# Altium schematic sheet 795484912NUCLEO-DG_V3.SchDoc
size A4
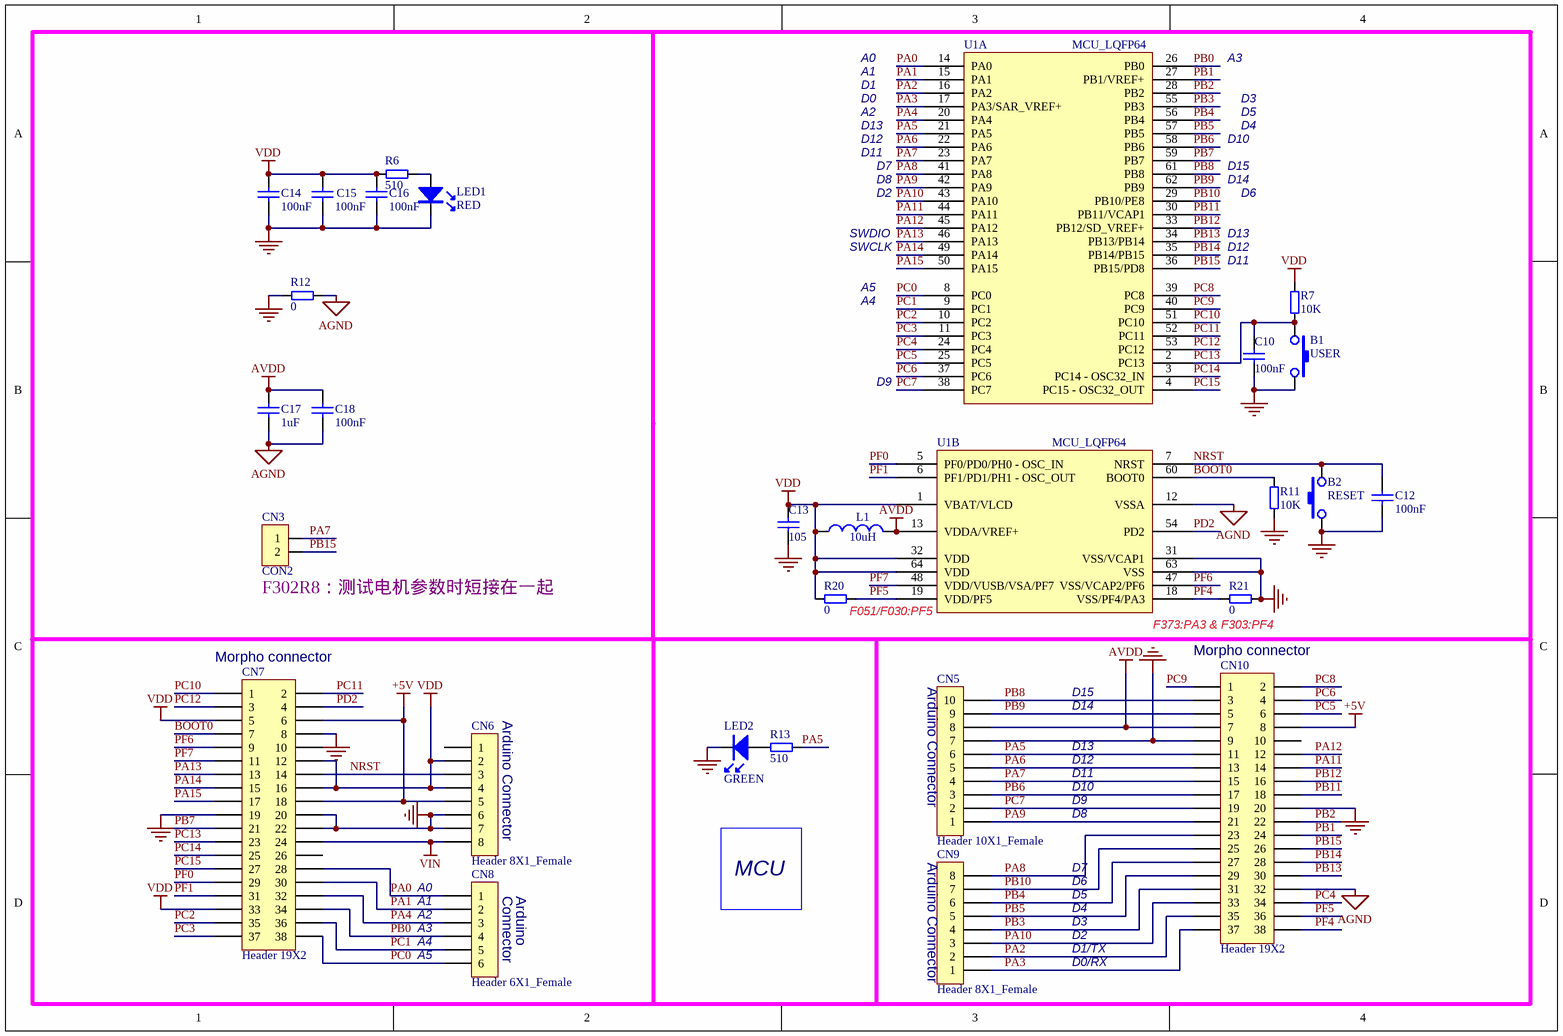
[diagram p0: 795484912NUCLEO-DG_V3.SchDoc]

## Parts
B1  USER  [KG6*6TP]
B2  RESET  [KG6*6TP]
C10  100nF  [0603C]
C12  100nF  [0603C]
C13  105  [0603C]
C14  100nF  [0603C]
C15  100nF  [0603C]
C16  100nF  [0603C]
C17  1uF  [0603C]
C18  100nF  [0603C]
CN3  CON2  [SIP2]
CN5  Header 10X1_Female  [1*10P_FEMALE]
CN6  Header 8X1_Female  [1*8P_FEMALE]
CN7  Header 19X2  [2*19P]
CN8  Header 6X1_Female  [1*6P_FEMALE]
CN9  Header 8X1_Female  [1*8P_FEMALE]
CN10  Header 19X2  [2*19P]
L1  10uH  [0603]
LED1  RED  [0603D]
LED2  GREEN  [0603D]
R6  510  [0603]
R7  10K  [0603]
R11  10K  [0603]
R12  0  [0603]
R13  510  [0603]
R20  0  [0603]
R21  0  [0603]
U1  MCU_LQFP64  [LQFP-64]  (parts A,B of 2)

## Nets
+5V: CN6.5 CN7.6 CN7.18 CN10.8
AGND: C17.2 C18.2 CN10.32 R12.2 U1.12(VSSA)
AVDD: C17.1 C18.1 CN5.8 CN10.7 L1.2 U1.13(VDDA/VREF+)
GND: B1.1 B2.1 C10.1 C12.1 C13.2 C14.2 C15.2 C16.2 CN5.7 CN6.6 CN6.7 CN7.8 CN7.19 CN7.20 CN7.22 CN10.9 CN10.20 LED1.K LED2.K R11.1 R12.1 R21.1 U1.31(VSS/VCAP1) U1.63(VSS)
VDD: C13.1 C14.1 C15.1 C16.1 CN6.2 CN6.4 CN7.5 CN7.12 CN7.16 CN7.33 L1.1 R6.2 R7.2 R20.2 U1.1(VBAT/VLCD) U1.32(VDD) U1.64(VDD)
VIN: CN6.8 CN7.24
BOOT0: CN7.7 R11.2 U1.60(BOOT0)
NRST: B2.2 C12.2 CN6.3 CN7.14 U1.7(NRST)
PA0: CN7.28 CN8.1 U1.14(PA0)
PA1: CN7.30 CN8.2 U1.15(PA1)
PA2: CN9.2 CN10.35 U1.16(PA2)
PA3: CN9.1 CN10.37 U1.17(PA3/SAR_VREF+)
PA4: CN7.32 CN8.3 U1.20(PA4)
PA5: CN5.6 CN10.11 R13.2 U1.21(PA5)
PA6: CN5.5 CN10.13 U1.22(PA6)
PA7: CN3.1 CN5.4 CN10.15 U1.23(PA7)
PA8: CN9.8 CN10.23 U1.41(PA8)
PA9: CN5.1 CN10.21 U1.42(PA9)
PA10: CN9.3 CN10.33 U1.43(PA10)
PA11: CN10.14 U1.44(PA11)
PA12: CN10.12 U1.45(PA12)
PA13: CN7.13 U1.46(PA13)
PA14: CN7.15 U1.49(PA14)
PA15: CN7.17 U1.50(PA15)
PB0: CN7.34 CN8.4 U1.26(PB0)
PB1: CN10.24 U1.27(PB1/VREF+)
PB2: CN10.22 U1.28(PB2)
PB3: CN9.4 CN10.31 U1.55(PB3)
PB4: CN9.6 CN10.27 U1.56(PB4)
PB5: CN9.5 CN10.29 U1.57(PB5)
PB6: CN5.3 CN10.17 U1.58(PB6)
PB7: CN7.21 U1.59(PB7)
PB8: CN5.10 CN10.3 U1.61(PB8)
PB9: CN5.9 CN10.5 U1.62(PB9)
PB10: CN9.7 CN10.25 U1.29(PB10/PE8)
PB11: CN10.18 U1.30(PB11/VCAP1)
PB12: CN10.16 U1.33(PB12/SD_VREF+)
PB13: CN10.30 U1.34(PB13/PB14)
PB14: CN10.28 U1.35(PB14/PB15)
PB15: CN3.2 CN10.26 U1.36(PB15/PD8)
PC0: CN7.38 CN8.6 U1.8(PC0)
PC1: CN7.36 CN8.5 U1.9(PC1)
PC2: CN7.35 U1.10(PC2)
PC3: CN7.37 U1.11(PC3)
PC4: CN10.34 U1.24(PC4)
PC5: CN10.6 U1.25(PC5)
PC6: CN10.4 U1.37(PC6)
PC7: CN5.2 CN10.19 U1.38(PC7)
PC8: CN10.2 U1.39(PC8)
PC9: CN10.1 U1.40(PC9)
PC10: CN7.1 U1.51(PC10)
PC11: CN7.2 U1.52(PC11)
PC12: CN7.3 U1.53(PC12)
PC13: B1.2 C10.2 CN7.23 R7.1 U1.2(PC13)
PC14: CN7.25 U1.3(PC14_-_OSC32_IN)
PC15: CN7.27 U1.4(PC15_-_OSC32_OUT)
PD2: CN7.4 U1.54(PD2)
PF0: CN7.29 U1.5(PF0/PD0/PH0_-_OSC_IN)
PF1: CN7.31 U1.6(PF1/PD1/PH1_-_OSC_OUT)
PF4: CN10.38 R21.2 U1.18(VSS/PF4/PA3)
PF5: CN10.36 R20.1 U1.19(VDD/PF5)
PF6: CN7.9 U1.47(VSS/VCAP2/PF6)
PF7: CN7.11 U1.48(VDD/VUSB/VSA/PF7)
NetLED1_A: LED1.A R6.1
NetLED2_A: LED2.A R13.1

Not connected (* = marked no-connect by the designer): CN6 1; CN7 10 26; CN10 10

## Notes on the sheet
- A0
- A1
- A2
- D0
- D1
- A3
- D3
- D5
- D12
- D11
- D13
- D7
- D15
- D10
- D4
- SWCLK
- SWDIO
- D2
- D8
- D14
- D6
- A4
- A5
- D9
- (near CN3) F302R8：测试电机参数时短接在一起
- F051/F030:PF5
- F373:PA3 & F303:PF4
- Morpho connector
- (near CN7) Morpho connector
- (near CN6) Arduino Connector
- (near CN5) Arduino Connector
- (near CN8) A1
- (near CN8) A2
- (near CN8) Connector
- (near CN8) Arduino
- MCU
- (near CN9) Arduino Connector
- (near CN8) A3
- (near CN8) A4
- (near CN8) A5
- D0/RX
- D1/TX

## Library data of the parts
B1 B2 = SW6: K
C10 C12 = CAP: Capacitor; Value: 100pF; Published: 8-Jun-2000; Revision: July-2002: Re-released for DXP Platform.; Publisher: Altium Limited
C13 = CAP SMD 0603  X5R 1礔 25V 10%: 0603  X5R 1礔; Rated voltage: 25V; Tolerance: 10%; Manufacturer: *; Manufacturer P/N: *; Order code Farnell: 1288202RL; Value: 1礔; Power: *; Technology: X5R; Temperature  Factor: *; Temperature Max: +125癈; Temperature Min: -55癈; STS Code: *
C14-C18 = Cap: Capacitor; Value: 10nF; Published: 8-Jun-2000; Revision: July-2002: Re-released for DXP Platform.; Publisher: Altium Limited
CN3 = CON2: J
CN5 = Header 10X1_Female: Header, 10-Pin, Single row,female; LatestRevisionDate: 17-Jul-2002; LatestRevisionNote: Re-released for DXP Platform.; Publisher: Altium Limited
CN6 CN9 = Header 8X1_Female: Header, 8-Pin, Single row,female; LatestRevisionDate: 17-Jul-2002; LatestRevisionNote: Re-released for DXP Platform.; Publisher: Altium Limited
CN7 CN10 = Header 19X2: Header, 19-Pin, Dual row; Revision: 17-Jul-2002: Re-released for DXP Platform.; Publisher: Altium Limited
CN8 = Header 6X1_Female: Header, 6-Pin, Single row,female; LatestRevisionDate: 17-Jul-2002; LatestRevisionNote: Re-released for DXP Platform.; Publisher: Altium Limited
L1 = Inductor: Value: 100uH; Published: 8-Jun-2000; Revision: July-2002: Re-released for DXP Platform.; Publisher: Altium Limited
LED1 LED2 = LED
R6 R12 R13 R20 R21 = R: 10K
R7 R11 = R